# EAGLE design powermeter (EAGLE 5.11)
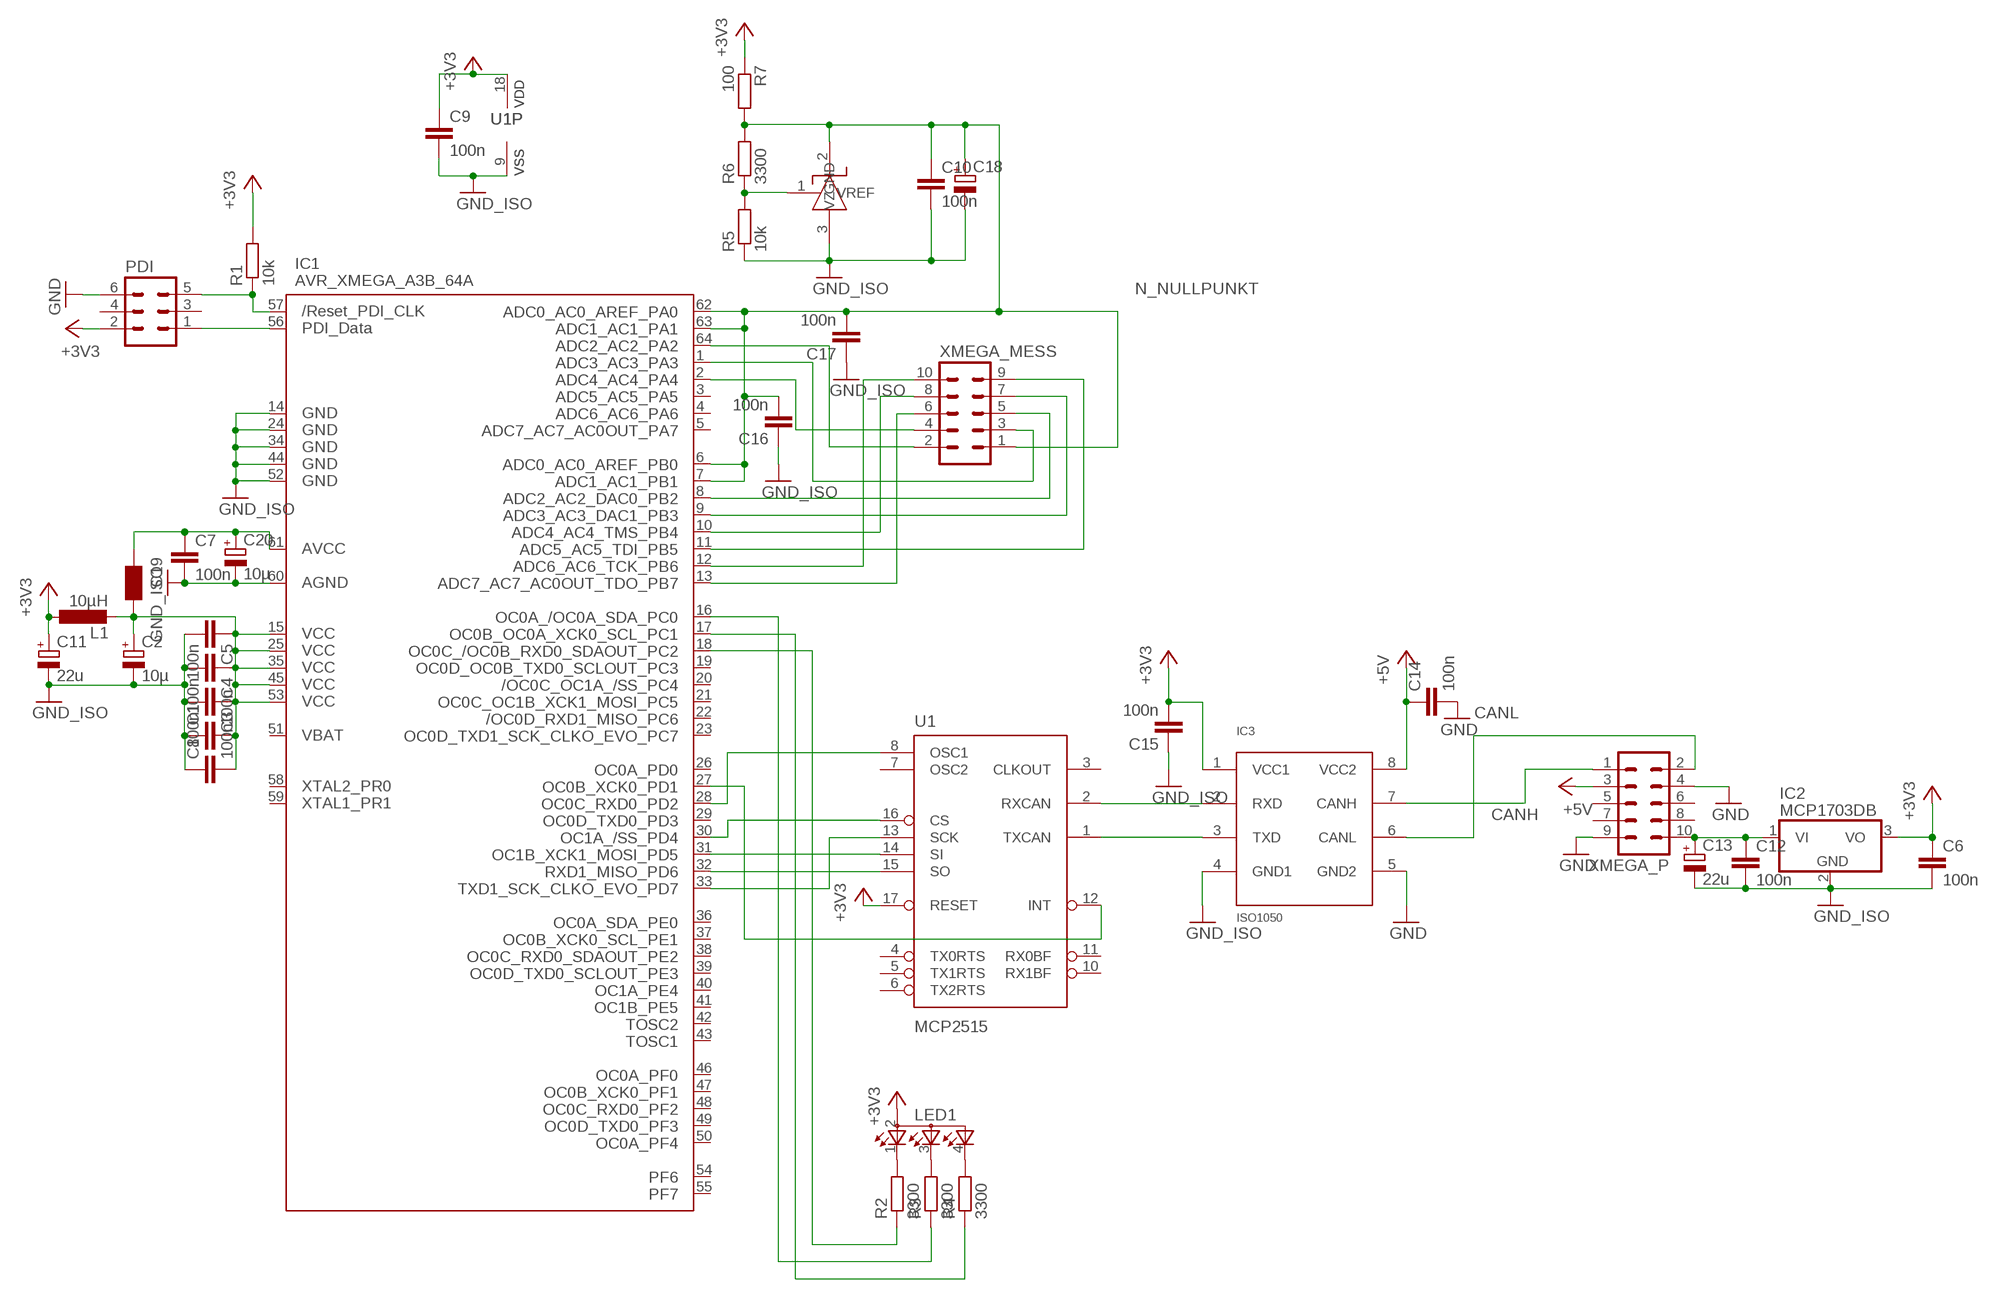
[diagram p0: schematic, sheet 1]

## Parts
C1  100n  C-EUC0805  [C0805]
C2  10µ  CPOL-EUSMCB  [SMC_B]
C3  100n  C-EUC0805  [C0805]
C4  100n  C-EUC0805  [C0805]
C5  100n  C-EUC0805  [C0805]
C6  100n  C-EUC0805  [C0805]
C7  100n  C-EUC0805  [C0805]
C8  100n  C-EUC0805  [C0805]
C9  100n  C-EUC0805  [C0805]
C10  100n  C-EUC0805  [C0805]
C11  22u  CPOL-EUSMCB  [SMC_B]
C12  100n  C-EUC0805  [C0805]
C13  22u  CPOL-EUSMCB  [SMC_B]
C14  100n  C-EUC0805  [C0805]
C15  100n  C-EUC0805  [C0805]
C16  100n  C-EUC0805  [C0805]
C17  100n  C-EUC0805  [C0805]
C18  CPOL-EUCT3528  [CT3528]
C19  WE-CBF_0805  [0805]
C20  10µ  CPOL-EUSMCB  [SMC_B]
IC1  AVR_XMEGA_A3B_64A  [TQFP64]
IC2  MCP1703DB  [SOT223]
IC3  ISO1050  [DUB]
L1  10µH  L-EUL3225M  [L3225M]
LED1  TOPLED-3P-LCCO  [PLCC]
PDI  ML6  [ML6]
R1  10k  R-EU_M0805  [M0805]
R2  3300  R-EU_M0805  [M0805]
R3  3300  R-EU_M0805  [M0805]
R4  3300  R-EU_M0805  [M0805]
R5  10k  R-EU_M0805  [M0805]
R6  3300  R-EU_M0805  [M0805]
R7  100  R-EU_M0805  [M0805]
U1  MCP2515  [SO18W_LONG]
U$1  ZR431L  [SOT23]
XMEGA_MESS  ML10  [ML10]
XMEGA_P  ML10  [ML10]

## Nets
+3V3: C6.1 C9.1 C11.+ C15.2 IC2.3(VO) IC3.1(VCC1) L1.1 LED1.2(A2) PDI.2 R1.2 R7.1 U1.17(RESET) U1.18(VDD)
+5V: C14.1 IC3.8(VCC2) XMEGA_P.3
CANH: IC3.7(CANH) XMEGA_P.1
CANL: IC3.6(CANL) XMEGA_P.2
GND: C14.2 IC3.5(GND2) XMEGA_P.4
GND_ISO: C1.1 C2.- C3.2 C4.2 C5.2 C6.2 C7.2 C8.1 C9.2 C10.2 C11.- C12.2 C13.- C15.1 C16.1 C17.1 C18.- C20.- IC1.14(GND1) IC1.24(GND2) IC1.34(GND3) IC1.44(GND4) IC1.52(GND5) IC1.60(AGND) IC2.2(GND) IC3.4(GND1) PDI.6 R5.1 U1.9(VSS) U$1.3(GND) XMEGA_P.9 ; supply symbol labelled GND
N$1: IC1.57(RESET) PDI.5 R1.1
N$2: C1.2 C2.+ C3.1 C4.1 C5.1 C8.2 C19.2 IC1.15(VCC1) IC1.25(VCC2) IC1.35(VCC3) IC1.45(VCC4) IC1.53(VCC5) L1.2
N$3: C12.1 C13.+ IC2.1(VI) XMEGA_P.10
N$4: LED1.1(CRED) R2.2
N$5: LED1.3(CBLUE) R3.2
N$6: C7.1 C19.1 C20.+ IC1.61(AVCC)
N$7: IC3.2(RXD) U1.2(RXCAN)
N$8: IC3.3(TXD) U1.1(TXCAN)
N$9: LED1.4(CGREEN) R4.2
N$10: IC1.17(PC1) R4.1
N$11: IC1.16(PC0) R3.1
N$12: IC1.30(PD4) U1.16(CS)
N$13: IC1.33(PD7) U1.13(SCK)
N$14: IC1.64(PA2) XMEGA_MESS.2
N$15: IC1.31(PD5) U1.14(SI)
N$16: IC1.32(PD6) U1.15(SO)
N$17: IC1.27(PD1) U1.12(INT)
N$18: R5.2 R6.1 U$1.1(VREF)
N$19: IC1.56(PDI_DATA) PDI.1
N$20: IC1.18(PC2) R2.1
N$22: IC1.1(PA3) XMEGA_MESS.3
N$23: IC1.2(PA4) XMEGA_MESS.4
N$24: IC1.12(PB6) XMEGA_MESS.10
N$25: IC1.8(PB2) XMEGA_MESS.5
N$26: IC1.13(PB7) XMEGA_MESS.6
N$29: IC1.28(PD2) U1.8(OSC1)
N$32: IC1.10(PB4) XMEGA_MESS.8
N$33: IC1.11(PB5) XMEGA_MESS.9
N$34: IC1.9(PB3) XMEGA_MESS.7
N_NULLPUNKT: C10.1 C16.2 C17.2 C18.+ IC1.6(PB0) IC1.7(PB1) IC1.62(PA0) IC1.63(PA1) R6.2 R7.2 U$1.2(VZ) XMEGA_MESS.1
Unconnected: IC1.3(PA5) IC1.4(PA6) IC1.5(PA7) IC1.19(PC3) IC1.20(PC4) IC1.21(PC5) IC1.22(PC6) IC1.23(PC7) IC1.26(PD0) IC1.29(PD3) IC1.36(PE0) IC1.37(PE1) IC1.38(PE2) IC1.39(PE3) IC1.40(PE4) IC1.41(PE5) IC1.42(TOSC2) IC1.43(TOSC1) IC1.46(PF0) IC1.47(PF1) IC1.48(PF2) IC1.49(PF3) IC1.50(PF4) IC1.51(VBAT) IC1.54(PF6) IC1.55(PF7) IC1.58(PR0) IC1.59(PR1) PDI.3 PDI.4 U1.3(CLKOUT) U1.4(TX0RTS) U1.5(TX1RTS) U1.6(TX2RTS) U1.7(OSC2) U1.10(RX1BF) U1.11(RX0BF) XMEGA_P.5 XMEGA_P.6 XMEGA_P.7 XMEGA_P.8

## Library data of the parts
C1 C3-C10 C12 C14-C17 = rcl:C-EU: CAPACITOR, European symbol
C2 C11 C13 C18 C20 = rcl:CPOL-EU: POLARIZED CAPACITOR, European symbol
C19 = wuerth-elektronik:WE-CBF: SMD EMI Suppression Ferrite Beads - excellent anti-EMI properties - low DCR - impedances till 3000 ohms - rated current up to 6 A
IC1 = xmega:AVR_XMEGA_A3B_: Device for Atmel AVR XMEGA A3B Series
IC2 = linear:MCP1703: 250 mA, 16V, Low Quiescent Current LDO Regulator Source: http://ww1.microchip.com/downloads/en/DeviceDoc/22049b.pdf
IC3 = Labor:ISO1050: Isolated CAN transceiver FEATURES 5000-VRMS Isolation (DW Package) 2500-VRMS Isolation (DUB Package) Failsafe Outputs Low Loop Delay: 150 ns Typical 50 kV/ms Typical Transient Immunity Meets or Exceeds ISO 11898 requirements Bus-Fault Protection of ?27 V to 40 V Dominant Time-Out Function IEC 60747-5-2 (VDE 0884, Rev. 2) & IEC 61010-1 Approved UL 1577, IEC 60950-1 and CSA Approvals Pending 3.3-V Inputs are 5-V Tolerant
L1 = rcl:L-EU: INDUCTOR, European symbol
LED1 = Labor:TOPLED-3: OSRAM - Hyper Multi TOPLED® (RGB) LB E673, LV E673, LT E673 - Power TOPLED® Enhanced optical Power LED (HOP2000) LS E67B, LA E67B, LO E67B, LY E67B - Hyper Multi TOPLED® Enhanced optical Power LED (HOP2000 / ATON®) LATB T66B - Hyper Multi TOPLED® Hyper-Bright LED LATB T686 Source: http://www.osram.convergy.de/
PDI = con-ml:ML6: HARTING
R1-R7 = rcl:R-EU_: RESISTOR, European symbol
U1 = untitled:MCP2515
U$1 = Labor:ZR431L: ZR431L (ADJUSTABLE PRECISION SHUNT REGULATOR) SOT23 1.24V
XMEGA_MESS XMEGA_P = con-ml:ML10: HARTING

## Board
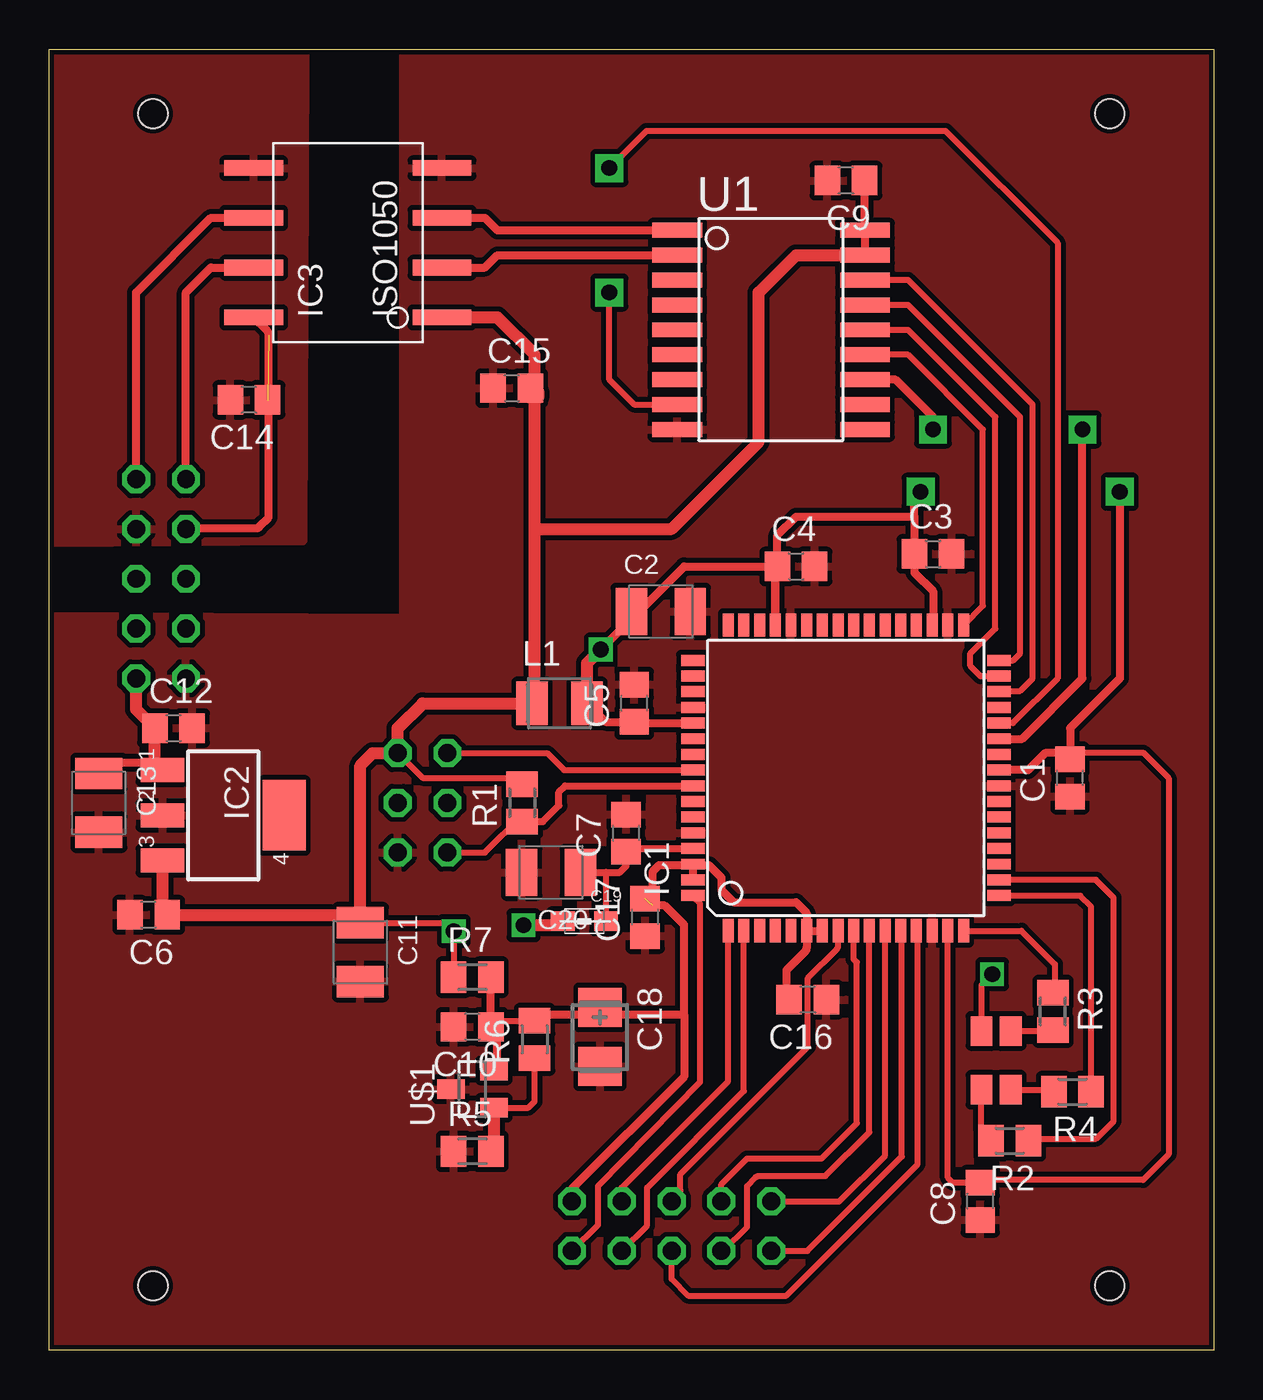
[diagram p1: board, top side]
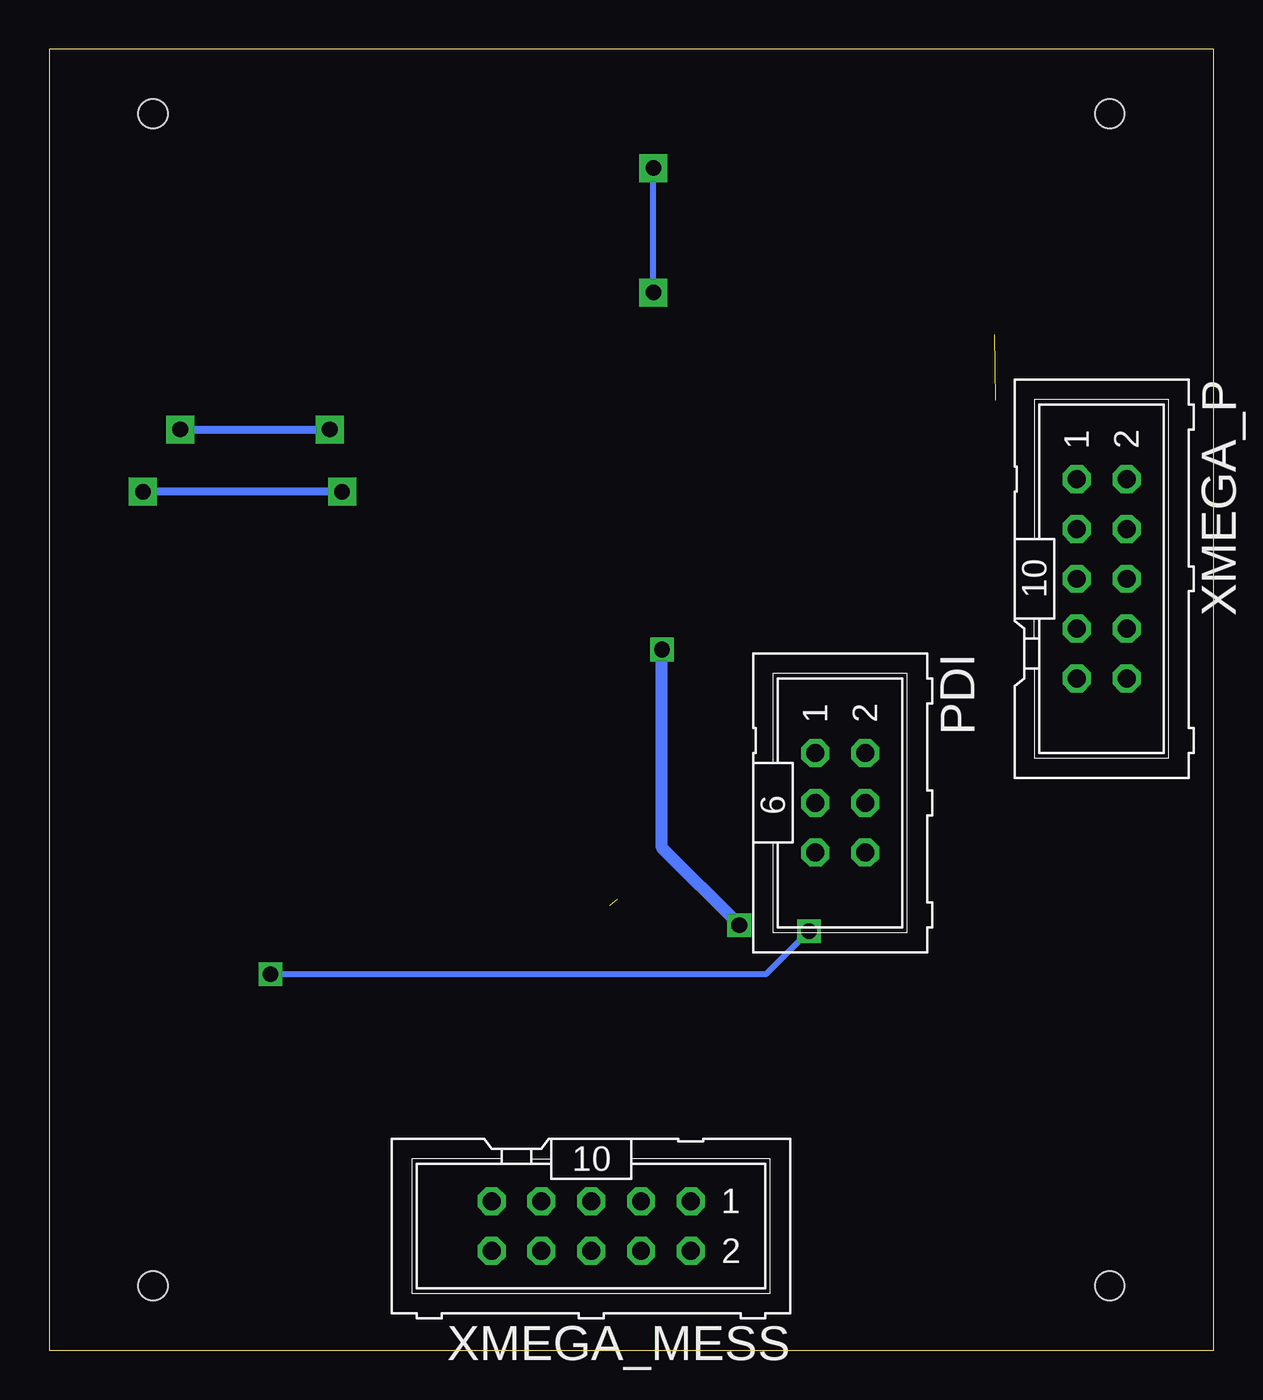
[diagram p2: board, bottom side, seen from below]

Size 59.4 x 66.4 mm. Coordinates in mm from the lower left corner, seen from the top.
Outline: 0,66.4 59.4,66.4 59.4,0 0,0 0,66.4
Copper layers (1*16): Top 0.035mm / dielectric 1.5mm / Bottom 0.035mm
Design rules "default *": minimum track width 10mil, minimum drill 24mil, track to track 8mil, track to pad 8mil, pad to pad 8mil, via to via 8mil, smd to smd 8mil, copper to edge 4mil, drill to drill 8mil, minimum pad ring 10mil, minimum via ring 8mil, stop-mask expansion 4mil, vias tented up to drill 0mil, thermal gap 10mil
Holes 1.5 mm at 5.3,63.1 54.1,63.1 5.3,3.3 54.1,3.3

### Footprints (pad centres in the part's own frame; a part is rotated, then mirrored left to right if it is on the bottom)
C0805 = smd 1.3 x 1.5: 1 -0.95,0; 2 0.95,0
SMC_B = smd 1.6 x 2.4: + -1.5,0; - 1.5,0
CT3528 = smd 2 x 2.2: + -1.5,0; - 1.5,0
0805 = smd 1.2 x 1: 1 -1.1,0; 2 1.1,0
TQFP64 = smd 1.194 x 0.559: 1 -7.8,6; 2 -7.8,5.2; 3 -7.8,4.4; 4 -7.8,3.6; 5 -7.8,2.8; 6 -7.8,2; 7 -7.8,1.2; 8 -7.8,0.4; 9 -7.8,-0.4; 10 -7.8,-1.2; 11 -7.8,-2; 12 -7.8,-2.8; 13 -7.8,-3.6; 14 -7.8,-4.4; 15 -7.8,-5.2; 16 -7.8,-6; 33 7.8,-6; 34 7.8,-5.2; 35 7.8,-4.4; 36 7.8,-3.6; 37 7.8,-2.8; 38 7.8,-2; 39 7.8,-1.2; 40 7.8,-0.4; 41 7.8,0.4; 42 7.8,1.2; 43 7.8,2; 44 7.8,2.8; 45 7.8,3.6; 46 7.8,4.4; 47 7.8,5.2; 48 7.8,6 | smd 0.559 x 1.194: 17 -6,-7.8; 18 -5.2,-7.8; 19 -4.4,-7.8; 20 -3.6,-7.8; 21 -2.8,-7.8; 22 -2,-7.8; 23 -1.2,-7.8; 24 -0.4,-7.8; 25 0.4,-7.8; 26 1.2,-7.8; 27 2,-7.8; 28 2.8,-7.8; 29 3.6,-7.8; 30 4.4,-7.8; 31 5.2,-7.8; 32 6,-7.8; 49 6,7.8; 50 5.2,7.8; 51 4.4,7.8; 52 3.6,7.8; 53 2.8,7.8; 54 2,7.8; 55 1.2,7.8; 56 0.4,7.8; 57 -0.4,7.8; 58 -1.2,7.8; 59 -2,7.8; 60 -2.8,7.8; 61 -3.6,7.8; 62 -4.4,7.8; 63 -5.2,7.8; 64 -6,7.8
SOT223 = smd 1.219 x 2.235: 1 -2.311,-3.099; 2 0,-3.099; 3 2.311,-3.099 | smd 3.6 x 2.2: 4 0,3.099
DUB = smd 0.8 x 3: 1 -3.81,-4.8; 2 -1.27,-4.8; 3 1.27,-4.8; 4 3.81,-4.8; 5 3.81,4.8; 6 1.27,4.8; 7 -1.27,4.8; 8 -3.81,4.8
L3225M = smd 1.6 x 2.2: 1 -1.4,0; 2 1.4,0
PLCC = smd 1.1 x 1.5: 1 -0.75,-1.5; 2 -0.75,1.5; 3 0.75,1.5; 4 0.75,-1.5
ML6 = drill 0.914 octagon: 1 -2.54,-1.27; 2 -2.54,1.27; 3 0,-1.27; 4 0,1.27; 5 2.54,-1.27; 6 2.54,1.27
M0805 = smd 1.3 x 1.6: 1 -0.95,0; 2 0.95,0
SO18W_LONG = smd 0.762 x 2.54: 1 -5.08,-4.788; 2 -3.81,-4.788; 3 -2.54,-4.788; 4 -1.27,-4.788; 5 0,-4.788; 6 1.27,-4.788; 7 2.54,-4.788; 8 3.81,-4.788; 9 5.08,-4.788; 10 5.08,4.788; 11 3.81,4.788; 12 2.54,4.788; 13 1.27,4.788; 14 0,4.788; 15 -1.27,4.788; 16 -2.54,4.788; 17 -3.81,4.788; 18 -5.08,4.788
SOT23 = smd 1 x 1.4: 1 -0.95,-1.1; 2 0.95,-1.1; 3 0,1.1
ML10 = drill 0.914 octagon: 1 -5.08,-1.27; 2 -5.08,1.27; 3 -2.54,-1.27; 4 -2.54,1.27; 5 0,-1.27; 6 0,1.27; 7 2.54,-1.27; 8 2.54,1.27; 9 5.08,-1.27; 10 5.08,1.27

### Placement (x,y rotation side)
C1  52.07,29.21 90 top
C2  31.2,37.7 0 top
C3  45.09,40.64 0 top
C4  38.1,40.01 0 top
C5  29.84,33.02 90 top
C6  5.08,22.23 180 top
C7  29.43,26.39 90 top
C8  47.49,7.62 90 top
C9  40.64,59.69 180 top
C10  21.59,16.51 180 top
C11  15.88,20.32 270 top
C12  6.35,31.75 0 top
C13  2.54,27.94 270 top
C14  10.2,48.5 180 top
C15  23.6,49.1 0 top
C16  38.7,17.9 180 top
C17  30.4,22.1 90 top
C18  28.1,16 270 top
C19  27.3,21.9 180 top
C20  25.6,24.4 180 top
IC1  40.64,29.21 90 top
IC2  8.89,27.3 270 top
IC3  15.24,56.52 90 top
L1  26.04,33.02 0 top
LED1  48.3,14.8 0 top
PDI  19.05,27.94 270 bottom
R1  24.13,27.94 90 top
R2  49,10.7 180 top
R3  51.2,17.3 270 top
R4  52.2,13.2 180 top
R5  21.59,10.16 0 top
R6  24.77,15.88 90 top
R7  21.59,19.05 0 top
U1  36.83,52.07 270 top
U$1  21.59,13.34 90 top
XMEGA_MESS  31.75,6.35 180 bottom
XMEGA_P  5.71,39.37 270 bottom

### Tracks (layer width: path | path; a pad name or v marks a point on that pad's centre or on a via)
+3V3  (via drill 0.8)
  Top 0.305: PDI.2 19.05,29.21 23.82,29.21 R1.2 | LED1.2 47.55,18.65 v48.1,19.2 | R7.1 v20.64,21.4 20.22,21.82 C11.+
  Top 0.406: U1.18 42.55,57.15 | U1.17 42.55,55.88 | 41.27,55.88 U1.17 | U1.17 U1.18 | U1.18 41.59,57.15 C9.1
  Top 0.61: IC2.3 5.79,22.46 C6.1 15.88,22.23 | 15.88,22.23 C11.+ | IC3.1 22.86,52.7 24.77,50.8 24.77,48.7 24.77,41.91 | 24.77,41.91 24.77,34.42 L1.1 19.05,33.02 17.78,31.75 PDI.2 16.51,30.48 15.88,29.84 15.88,22.23 | 41.27,55.88 38.1,55.88 36.2,53.98 36.2,46.35 31.75,41.91 24.77,41.91
  Top 1.016: C15.2 24.69,48.96 arc-45 24.77,48.78 24.77,48.7
  Bottom 0.305: v48.1,19.2 22.84,19.2 v20.64,21.4
+5V  (1 unrouted)
  Top 0.406: IC3.8 11.13,52.02 arc-45 11.2,51.84 11.2,42.5 10.72,42.02 arc-45 10.54,41.95 7.08,41.95 arc45 XMEGA_P.3
CANH
  Top 0.406: XMEGA_P.1 6.99,53.98 8.26,55.24 IC3.7
CANL
  Top 0.406: IC3.6 8.26,57.78 4.45,53.98 XMEGA_P.2
GND
  pour Top (isolate 0.254, rank 2): 13.06,66.2 12.96,41.27 0.04,41.17 0.14,66.11
GND_ISO
  Top 0.406: U$1.3 20.64,13.48
  pour Top (isolate 0.254): 60.33,-0.64 60.33,67.31 18.05,67.21 18.05,37.37 -1.27,37.47 -1.27,-0.64
N$1
  Top 0.305: PDI.5 22.23,25.4 24.13,27.3 R1.1
  Top 0.357: IC1.57 26.32,28.81 26,28.49 26,27.8 25.19,26.99 R1.1
N$2  (via drill 0.8, 0.8 pad 1.42)
  Top 0.305: IC1.15 45.84,8.82 46.09,8.56 47,8.56 | 47,8.56 C8.2 | IC1.25 49.9,29.6 50.8,30.5 55.8,30.5 57.1,29.2 57.1,10 55.8,8.7 47.13,8.7 47,8.56
  Top 0.357: C2.+ 29.79,37.61 29.99,37.61
  Top 0.406: 45.04,37.2 IC1.35 45.09,37.05 45.09,38.73 44.13,39.69 C3.1 44.13,42.55 | 52.39,30.48 C1.2 51.75,30.48 | v54.61,43.81 54.61,34.29 52.07,31.75 52.07,30.48 51.75,30.48 | IC1.25 49.93,29.61 50.8,30.48 51.75,30.48 | IC1.53 29.91,32.01 C5.1 28.39,32.07 L1.2 | 27.94,35.56 v28.14,35.76 29.99,37.61 32.38,40.01 36.83,40.01 37.04,39.8 IC1.45 37.04,39.9 C4.1 37.15,41.59 38.1,42.55 44.13,42.55 | 44.13,42.55 44.13,43.5 v44.45,43.81
  Top 0.61: C19.2 26.15,21.7 v24.2,21.7 | v28.14,35.76 27.43,35.05 L1.2
  Bottom 0.406: v44.45,43.81 v54.61,43.81
  Bottom 0.61: v24.2,21.7 28.14,25.64 v28.14,35.76
N$3
  Top 0.406: 5.4,30.01 3.11,30.01 C13.+
  Top 0.61: XMEGA_P.10 4.45,32.7 C12.1 5.4,30.01 IC2.1
N$4
  Top 0.305: LED1.1 47.55,11.2 R2.2
N$5
  Top 0.305: LED1.3 51.15,16.3 R3.2
N$6
  Top 0.305: 28.4,24.4 C19.1
  Top 0.357: C20.+ 28.4,24.4 29.11,24.4 29.43,24.72 C7.1 29.59,25.61 IC1.61
N$7
  Top 0.406: U1.2 22.86,55.88 22.23,55.24 IC3.2
N$8
  Top 0.406: IC3.3 22.23,57.78 22.86,57.15 U1.1
N$9
  Top 0.305: LED1.4 51.15,13.3 R4.2
N$10
  Top 0.305: R4.1 53.15,22.65 52.6,23.2 IC1.17
N$11
  Top 0.305: IC1.16 49.59,21.41 51.3,19.7 51.3,18.35 R3.1
N$12
  Top 0.305: U1.16 43.81,54.61 50.16,48.26 50.16,34.29 49.53,33.66 48.48,33.66 IC1.30
N$13
  Top 0.305: U1.13 43.81,50.8 47.62,46.99 47.62,37.99 IC1.33
N$14
  Top 0.305: IC1.64 arc45 32.88,23.12 33.2,22.8 33.2,13.7 28,8.4 28,6.41 XMEGA_MESS.2
N$15
  Top 0.305: IC1.31 47.51,34.41 46.99,34.92 46.99,35.56 48.26,36.83 48.26,47.62 43.81,52.07 U1.14
N$16
  Top 0.305: IC1.32 49.18,35.21 49.53,35.56 49.53,47.62 43.81,53.34 U1.15
N$17  (via drill 0.8 pad 1.42)
  Top 0.406: IC1.27 49.62,31.21 52.7,34.29 v52.7,46.99 | U1.12 43.18,49.53 45.09,47.62 v45.09,46.99
  Bottom 0.406: v52.7,46.99 v45.09,46.99
N$18
  Top 0.305: U$1.1 24.45,12.38 24.77,12.7 R6.1
  Top 0.61: U$1.1 22.69,10.31 R5.2
N$19
  Top 0.305: PDI.1 25.4,30.48 26.27,29.61 IC1.56
N$20
  Top 0.305: IC1.18 53.39,24.01 54.3,23.1 54.3,11.7 53.4,10.8 50.05,10.8 R2.1
N$22
  Top 0.305: XMEGA_MESS.3 arc-45 29.2,7.64 29.2,8.3 34.64,13.74 IC1.1
N$23
  Top 0.305: IC1.2 35.44,13.24 30.5,8.3 30.5,6.37 XMEGA_MESS.4
N$24
  Top 0.305: IC1.12 arc-45 43.5,21.27 43.5,9.9 38.68,5.08 XMEGA_MESS.10
N$25
  Top 0.305: XMEGA_MESS.5 32.13,8 arc45 32.2,8.18 32.2,9 38.7,15.5 38.7,19 40.17,20.47 arc45 40.24,20.64 IC1.8
N$26
  Top 0.305: IC1.13 arc-45 44.3,21.27 44.3,9.5 37.6,2.8 32.6,2.8 31.75,3.65 XMEGA_MESS.6
N$29  (via drill 0.8 pad 1.42)
  Top 0.305: IC1.28 49.16,32.01 51.44,34.29 51.44,56.52 45.72,62.23 30.48,62.23 v28.57,60.33 | v28.57,53.98 28.57,49.53 29.84,48.26 U1.8
  Bottom 0.305: v28.57,53.98 v28.57,60.33
N$32
  Top 0.305: XMEGA_MESS.8 34.38,5.08 35.6,6.29 35.6,8.4 36.03,8.83 arc-45 36.2,8.9 39.6,8.9 41.84,11.14 IC1.10
N$33
  Top 0.305: XMEGA_MESS.9 arc45 36.88,7.6 40.3,7.6 42.64,9.94 IC1.11
N$34
  Top 0.305: XMEGA_MESS.7 34.29,8.49 35.6,9.8 39.4,9.8 41.2,11.6 41.2,19.8 41.04,19.96 IC1.9
N_NULLPUNKT  (1 unrouted)
  Top 0.305: 32.88,24.77 IC1.62 | 22.86,16.82 R6.2 25.09,17.14 | C18.+ 28.1,17.45 arc-45 28.03,17.27 27.9,17.14 | 37.6,18.02 arc45 C16.2
  Top 0.406: IC1.6 38.64,22.32 38.1,22.86 34.92,22.86 34.29,23.5 34.29,24.13 33.66,24.77 32.88,24.77 31.11,24.77 30.8,24.45 30.8,22.7 31.4,22.7 32.38,21.71 32.38,17.14 | C10.1 R7.2 | C10.1 22.54,16.2 22.86,15.88 22.86,14.46 U$1.2 | C10.1 22.86,16.82 | XMEGA_MESS.1 26.67,8.26 32.38,13.97 32.38,17.14 | 25.09,17.14 27.9,17.14 32.38,17.14 | IC1.6 IC1.7 | IC1.62 IC1.63 | IC1.6 38.64,20.55 arc-45 38.57,20.37 37.6,19.4 37.6,18.02